# Altium schematic sheet STM32G431CBU6.SchDoc
size A3; SheetNumber: 2; SheetTotal: 6
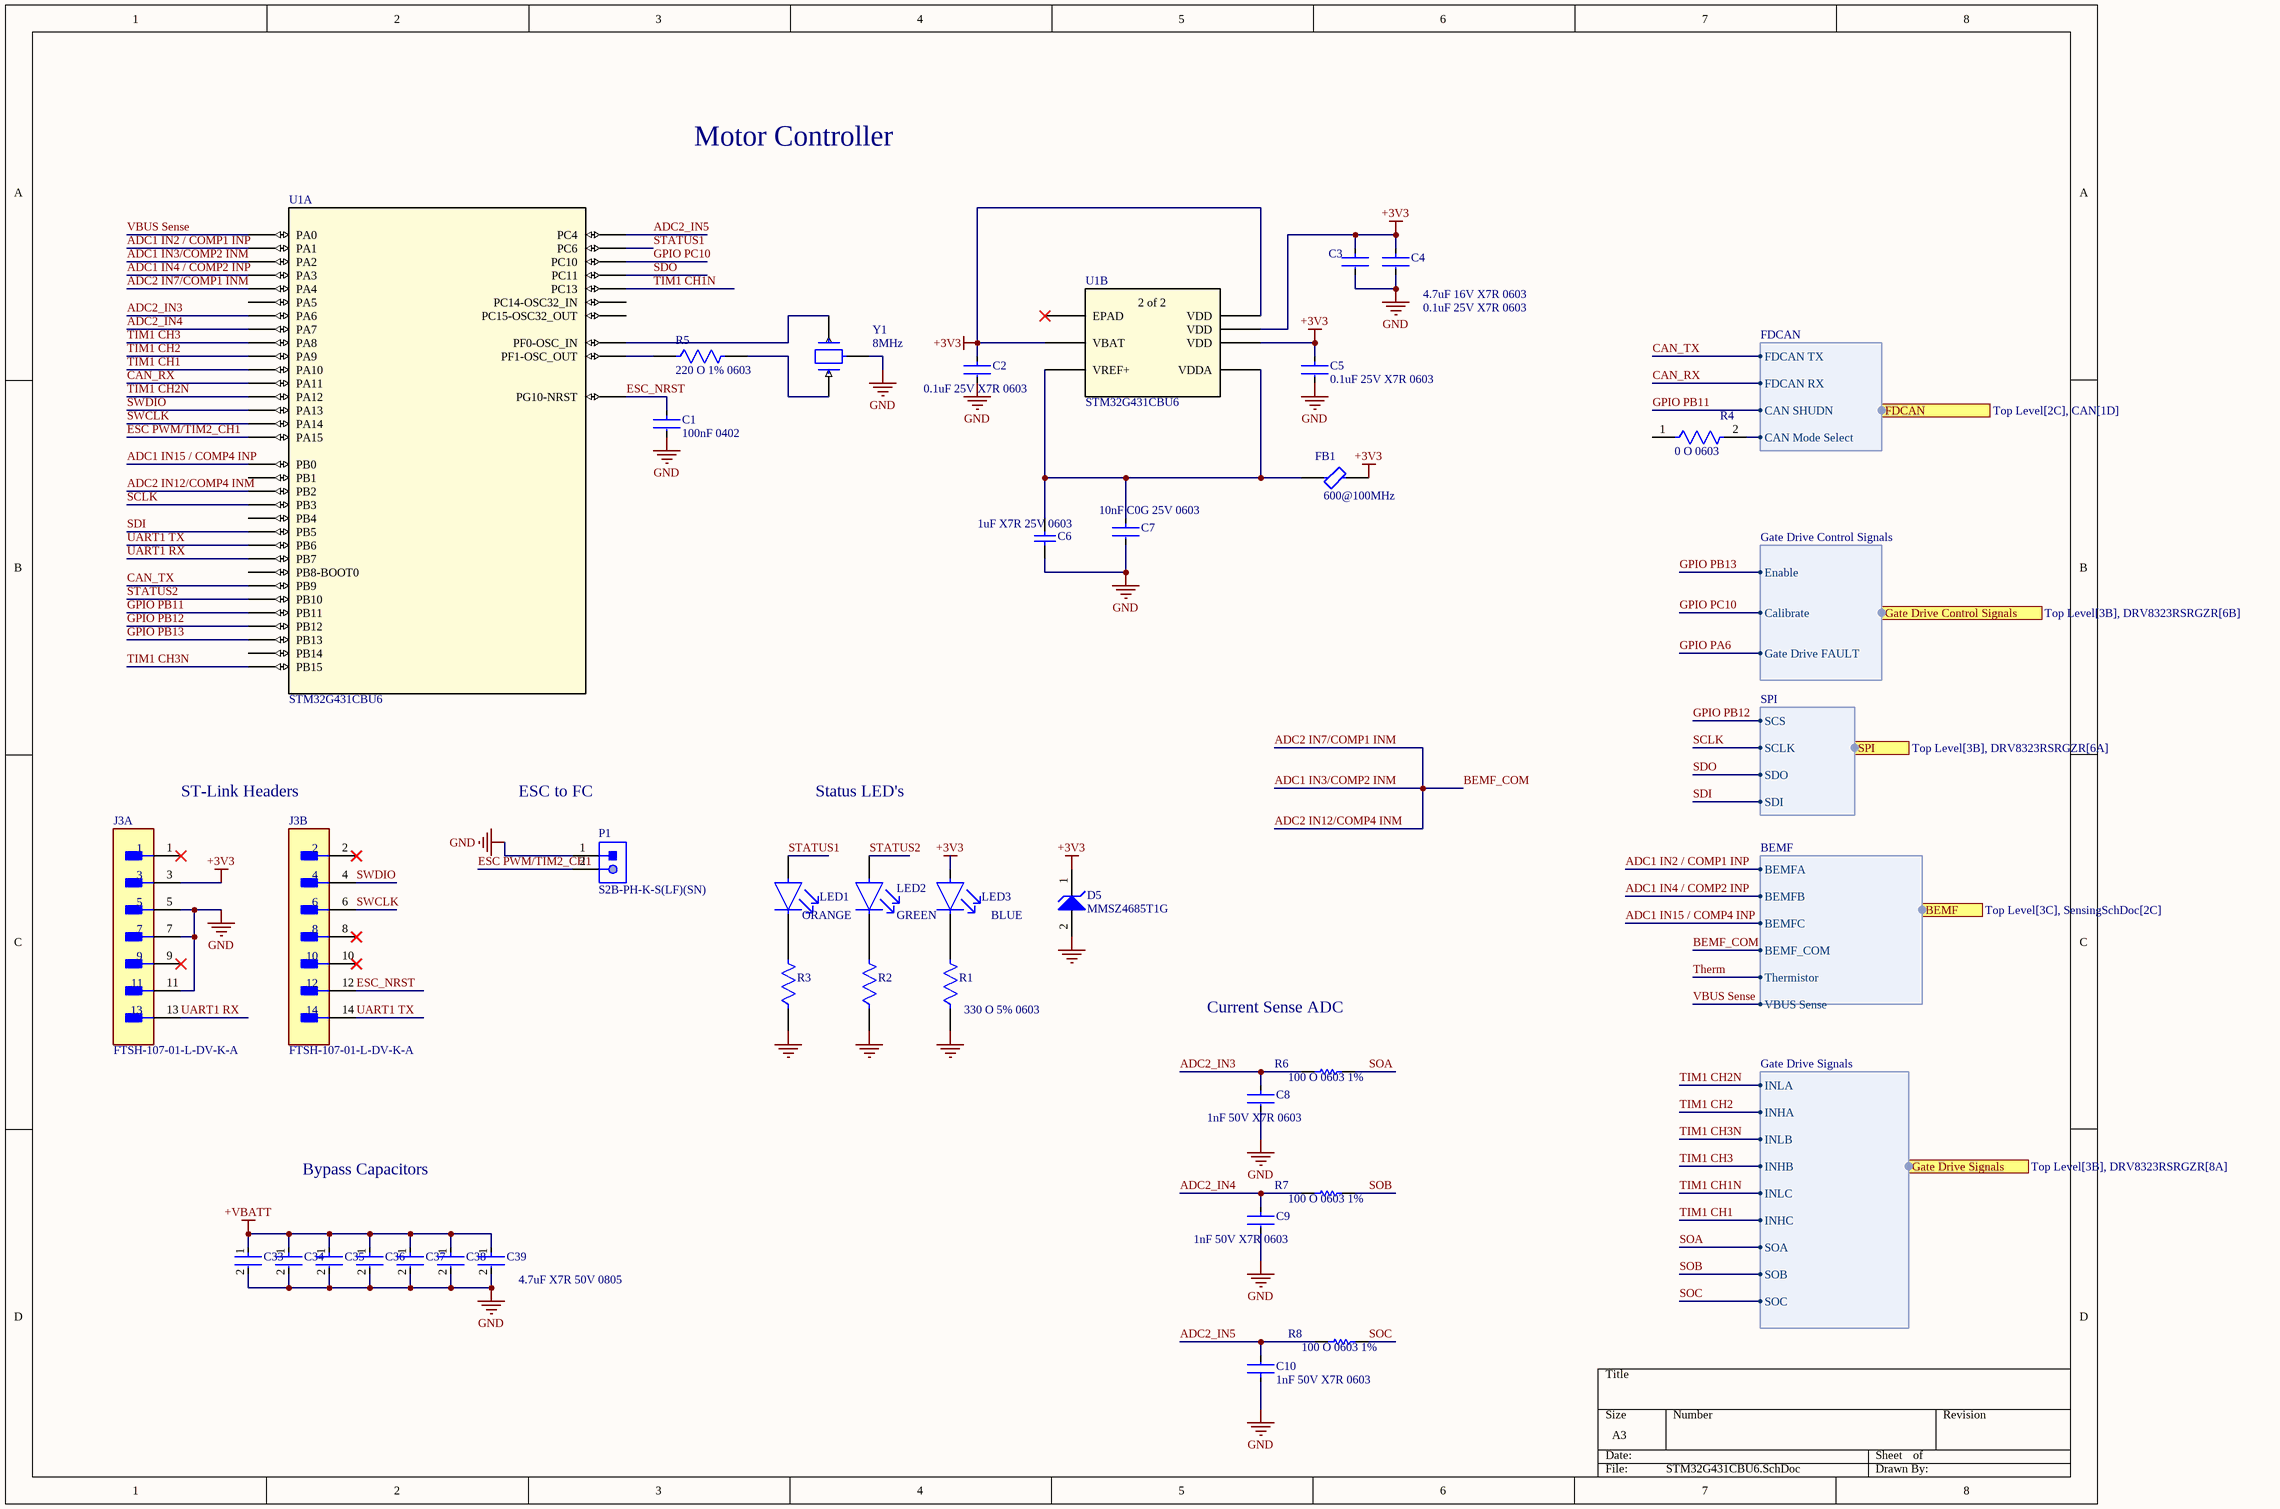
[diagram p0: STM32G431CBU6.SchDoc]

## Parts
C1  100nF 0402  [FP-GRM155-0_05-MFG]
C2  0.1uF 25V X7R 0603  [FP-C0603C-CF-MFG]
C3  4.7uF 16V X7R 0603  [FP-GRM188-0_2-IPC_A]
C4  0.1uF 25V X7R 0603  [FP-C0603C-CF-MFG]
C5  0.1uF 25V X7R 0603  [FP-C0603C-CF-MFG]
C6  1uF X7R 25V 0603  [CAPC1608X95X35NL15T15]
C7  10nF C0G 25V 0603  [FP-C0603C-CF-MFG]
C8  1nF 50V X7R 0603  [FP-C0603C-CF-MFG]
C9  1nF 50V X7R 0603  [FP-C0603C-CF-MFG]
C10  1nF 50V X7R 0603  [FP-C0603C-CF-MFG]
C33  4.7uF X7R 50V 0805  [FP-GRM21B-0_2-e0_2_0_7-IPC_C]  (value not drawn)
C34  4.7uF X7R 50V 0805  [FP-GRM21B-0_2-e0_2_0_7-IPC_C]  (value not drawn)
C35  4.7uF X7R 50V 0805  [FP-GRM21B-0_2-e0_2_0_7-IPC_C]  (value not drawn)
C36  4.7uF X7R 50V 0805  [FP-GRM21B-0_2-e0_2_0_7-IPC_C]  (value not drawn)
C37  4.7uF X7R 50V 0805  [FP-GRM21B-0_2-e0_2_0_7-IPC_C]  (value not drawn)
C38  4.7uF X7R 50V 0805  [FP-GRM21B-0_2-e0_2_0_7-IPC_C]  (value not drawn)
C39  4.7uF X7R 50V 0805  [FP-GRM21B-0_2-e0_2_0_7-IPC_C]
D5  MMSZ4685T1G  [ONSC-SOD-123-2-425-04_V]
FB1  600@100MHz  [FP-MPZ1608-0_8-MFG]
J3  FTSH-107-01-L-DV-K-A  [FP-FTSH-107-01-L-DV-K-A-MFG]  (parts A,B of 2)
LED1  ORANGE  [FP-6_541-5092_01-4-MFG]
LED2  GREEN  [FP-LTST-C193KGKT-5A-MFG]
LED3  BLUE  [FP-APT1608QBC-D-MFG]
P1  S2B-PH-K-S(LF)(SN)  [JST-S2B-PH-K-S_V]
R1  330 O 5% 0603  [FP-AC0603-IPC_C]
R2  AC0603JR-07330RL  [FP-AC0603-IPC_C]  (value not drawn)
R3  AC0603JR-07330RL  [FP-AC0603-IPC_C]  (value not drawn)
R4  0 O 0603  [FP-MCT0603-IPC_C]
R5  220 O 1% 0603  [FP-AC0603-IPC_A]
R6  100 O 0603 1%  [RESC1608X55X25ML10T15]
R7  100 O 0603 1%  [RESC1608X55X25ML10T15]
R8  100 O 0603 1%  [RESC1608X55X25ML10T15]
U1  STM32G431CBU6  [UFQFPN-48_7X7X0P55MM]  (parts A,B of 2)
Y1  8MHz  [FP-CSTNE8M00GH5C000R0-MFG]

## Ports
BEMF (harness BEMF, see Top Level[3C], SensingSchDoc[2C]), FDCAN (harness FDCAN, see Top Level[2C], CAN[1D]), Gate Drive Control Signals (harness Gate Drive Control Signals, see Top Level[3B], DRV8323RSRGZR[6B]), Gate Drive Signals (harness Gate Drive Signals, see Top Level[3B], DRV8323RSRGZR[8A]), SPI (harness SPI, see Top Level[3B], DRV8323RSRGZR[6A])

## Harnesses
SPI: SCLK, SDO, SDI, SCS
Gate Drive Signals: INLA, INHA, INLB, INHB, INLC, INHC, SOA, SOB, SOC
Gate Drive Control Signals: Enable, Calibrate, Gate Drive FAULT
BEMF: BEMFA, BEMFB, BEMFC, VBUS Sense, Thermistor, BEMF_COM
FDCAN: FDCAN TX, FDCAN RX, CAN SHUDN, CAN Mode Select

## Nets
+3V3: C2.1 C3.1 C4.1 C5.1 D5.1(K) FB1.2 J3.3 LED3.2(A) U1.1(VBAT) U1.23(VDD) U1.35(VDD) U1.48(VDD)
+VBATT: C33.1 C34.1 C35.1 C36.1 C37.1 C38.1 C39.1
GND: C1.2 C2.2 C3.2 C4.2 C5.2 C6.1 C7.2 C8.2 C9.2 C10.1 C33.2 C34.2 C35.2 C36.2 C37.2 C38.2 C39.2 D5.2(A) J3.5 J3.7 J3.11 P1.1 R1.1 R2.1 R3.1 Y1.2(GND)
ADC1 IN2 / COMP1 INP: U1.9(PA1) ; port BEMF.BEMFA
ADC1 IN3/COMP2 INM: U1.10(PA2) U1.12(PA4) U1.19(PB2) ; port BEMF.BEMF_COM  [also labelled ADC2 IN12/COMP4 INM, ADC2 IN7/COMP1 INM, BEMF_COM]
ADC1 IN4 / COMP2 INP: U1.11(PA3) ; port BEMF.BEMFB
ADC1 IN15 / COMP4 INP: U1.17(PB0) ; port BEMF.BEMFC
ADC2_IN3: C8.1 R6.1 U1.14(PA6)
ADC2_IN4: C9.1 R7.1 U1.15(PA7)
ADC2_IN5: C10.2 R8.1 U1.16(PC4)
CAN_RX: U1.33(PA11) ; port FDCAN.FDCAN RX
CAN_TX: U1.47(PB9) ; port FDCAN.FDCAN TX
ESC PWM/TIM2_CH1: P1.2 U1.38(PA15)
ESC_NRST: C1.1 J3.12 U1.7(PG10-NRST)
GPIO PA6: port Gate Drive Control Signals.Gate Drive FAULT
GPIO PB11: U1.24(PB11) ; port FDCAN.CAN SHUDN
GPIO PB12: U1.25(PB12) ; port SPI.SCS
GPIO PB13: U1.26(PB13) ; port Gate Drive Control Signals.Enable
GPIO PC10: U1.39(PC10) ; port Gate Drive Control Signals.Calibrate
SCLK: U1.41(PB3) ; port SPI.SCLK
SDI: U1.43(PB5) ; port SPI.SDI
SDO: U1.40(PC11) ; port SPI.SDO
SOA: R6.2 ; port Gate Drive Signals.SOA
SOB: R7.2 ; port Gate Drive Signals.SOB
SOC: R8.2 ; port Gate Drive Signals.SOC
STATUS1: LED1.2(A) U1.29(PC6)
STATUS2: LED2.2(A) U1.22(PB10)
SWCLK: J3.6 U1.37(PA14)
SWDIO: J3.4 U1.36(PA13)
Therm: port BEMF.Thermistor
TIM1 CH1: U1.32(PA10) ; port Gate Drive Signals.INHC
TIM1 CH1N: U1.2(PC13) ; port Gate Drive Signals.INLC
TIM1 CH2: U1.31(PA9) ; port Gate Drive Signals.INHA
TIM1 CH2N: U1.34(PA12) ; port Gate Drive Signals.INLA
TIM1 CH3: U1.30(PA8) ; port Gate Drive Signals.INHB
TIM1 CH3N: U1.28(PB15) ; port Gate Drive Signals.INLB
UART1 RX: J3.13 U1.45(PB7)
UART1 TX: J3.14 U1.44(PB6)
VBUS Sense: U1.8(PA0) ; port BEMF.VBUS Sense
NetC6_2: C6.2 C7.1 FB1.1 U1.20(VREF+) U1.21(VDDA)
NetLED1_1: LED1.1(C) R3.2
NetLED2_1: LED2.1(C) R2.2
NetLED3_1: LED3.1(C) R1.2
NetR4_2: R4.2 ; port FDCAN.CAN Mode Select
NetR5_1: R5.1 U1.6(PF1-OSC_OUT)
NetR5_2: R5.2 Y1.1(Input)
NetU1_5: U1.5(PF0-OSC_IN) Y1.3(Output)

Not connected (* = marked no-connect by the designer): J3 1* 2* 8* 9* 10*; R4 1; U1 3(PC14-OSC32_IN) 4(PC15-OSC32_OUT) 13(PA5) 18(PB1) 27(PB14) 42(PB4) 46(PB8-BOOT0) 49(EPAD)*

## Notes on the sheet
- Motor Controller
- ST-Link Headers
- ESC to FC
- Status LED's
- Current Sense ADC
- Bypass Capacitors
- (in symbol STM32G431CBU6, part B) 2 of 2

## Library data of the parts
C1 = CMP-06035-025734-1: Chip Multilayer Ceramic Capacitors for General Purpose, 0402, 0.10uF, X7R, 15%, 20%, 25V
C2 C4 C5 = CMP-2006-03731-2: CAP CER 0.1UF 25V X7R 0603; Manufacturer Part Number: C0603C104K3RACAUTO; Manufacturer: KEMET; Capacitance: 0.10 μF; Automotive Grade: Grade 1; Tolerance: 0.1; Material: Ceramic; Temperature Coefficient: 30ppm/°C; Value: 0.10 μF; Digikey Description: CAP CER 0.1UF 25V X7R 0603; RoHS: TRUE; ComponentLink2Description: Datasheet; Temperature Range High: +125°C; Temperature Characteristic: X7R; Automotive: Yes; Package: C0603C-CF; ComponentLink2URL: https://api.kemet.com/component-edge/download/datasheet/C0603C100J5GACAUTO.pdf; Lead Free: Yes; Device Class L2: Capacitors; Device Class L3: Ceramic Capacitors; Device Class L1: Passive Components; Octopart: https://octopart.com/c0603c104k3racauto-kemet-12595587; Height: 0.87mm; Mouser Description: Multilayer Ceramic Capacitors MLCC - SMD/SMT 0.1uF 25volts 10% X7R AUTO; Category: Cap; Voltage Rating: 25 V; Temperature Range Low: -55°C; Temperature: -55°C to +125°C
C3 = CMP-06035-045467-1: Chip Multilayer Ceramic Capacitors for General Purpose, 0603, 4.7uF, X7R, 15%, 10%, 16V
C6 = CMP-2006-02217-1: Part Number: C0603C105M3RACTU; Manufacturer: Kemet
C7 = CMP-03020-015349-1: C0603 10,000 pF C0G 30ppm/°C 5.00% 25 V; Manufacturer: KEMET; Manufacturer Part Number: C0603C103J3GACAUTO; Automotive Grade: Grade 1; Material: Ceramic; Tolerance: 0.05; Mouser Description: Cap Ceramic 0.01uF 25V C0G 5% Pad SMD 0603 125C Automotive T/R; Temperature Characteristic: C0G; Device Class L3: Ceramic Capacitors; Device Class L1: Passive Components; Capacitance: 10,000 pF; Temperature Range High: +125°C; Voltage Rating: 25 V; RoHS: TRUE; Temperature: -55°C to +125°C; Device Class L2: Capacitors; Temperature Range Low: -55°C; Package: C0603C-CF; Value: 10,000 pF; ComponentLink2Description: Datasheet; Height: 0.87mm; Octopart: https://octopart.com/c0603c103j3gacauto-kemet-75532652; Lead Free: Yes; Automotive: Yes; ComponentLink2URL: https://api.kemet.com/component-edge/download/datasheet/C0603C100J5GACAUTO.pdf; Category: Cap; Temperature Coefficient: 30ppm/°C
C8-C10 = CMP-2006-03716-2: CAP CER 1000PF 50V X7R 0603; Manufacturer Part Number: C0603C102K5RACAUTO; Manufacturer: KEMET; Material: Ceramic; Automotive Grade: Grade 1; Value: 1,000 pF; Tolerance: 0.1; Temperature Coefficient: 30ppm/°C; Category: Cap; Automotive: Yes; Temperature Range High: +125°C; Temperature Range Low: -55°C; Temperature Characteristic: X7R; Device Class L1: Passive Components; Height: 0.87mm; Lead Free: Yes; Capacitance: 1,000 pF; Package: C0603C-CF; Digikey Description: CAP CER 1000PF 50V X7R 0603; Voltage Rating: 50 V; ComponentLink2URL: https://api.kemet.com/component-edge/download/datasheet/C0603C100J5GACAUTO.pdf; Mouser Description: Multilayer Ceramic Capacitors MLCC - SMD/SMT 1000pF 50volts 10% X7R AUTO; RoHS: TRUE; Octopart: https://octopart.com/c0603c102k5racauto-kemet-18822673; Device Class L3: Ceramic Capacitors; ComponentLink2Description: Datasheet; Device Class L2: Capacitors; Temperature: -55°C to +125°C
C33-C39 = CMP-06035-056600-1: Chip Multilayer Ceramic Capacitors for General Purpose, 0805, 4.7uF, X7R, 15%, 10%, 50V
D5 = CMP-1060-00574-1: Zener Voltage Regulator, 500 mW, 2-Pin SOD-123, Pb-Free, Tape and Reel; Manufacturer: On Semiconductor; VZ Typ (V): 3.6; P Max (W): 0.5; DatasheetVersion: Rev. 9; ComponentLink2Description: Datasheet; Mounting Technology: Surface Mount; ComponentLink3URL: http://www.onsemi.com/pub_link/Collateral/425-04.PDF; ComponentLink3Description: Package Specification; RoHS: Pb-Free; PartNumber: MMSZ4685T1G; ComponentLink1URL: http://www.onsemi.com/; PackageDescription: 2-Pin SOD, Body 1.6 x 2.69 mm; ComponentLink2URL: http://www.onsemi.com/pub_link/Collateral/MMSZ4678T1-D.PDF; ComponentLink1Description: Manufacturer URL; Packing: Tape and Reel; PackageVersion: Rev. G, 10/2009; PackageReference: SOD-123-2-425-04
FB1 = CMP-08257-000179-1: Power line Ferrite Bead 600Ω @ 100MHz 1A DCR 0.15Ω SMD 0603; Impedance: 600R; DC Resistance (DCR): 150mR; Tolerance: 25%; Depth: 0.8mm; Packaging: Tape and Reel; Package Quantity: 4000; Height: 0.8mm; Length: 0.063inch; Series: MPZ; Weight: 7.1E-05oz; Width: 0.8mm; Mount: Surface Mount; Case Code (Imperial): 0603; Case/Package: 0603; Max Operating Temperature: 125°C; Max DC Current: 1A; Test Frequency: 100MHz; Min Operating Temperature: -55°C; Current Rating: 1A; Core Material: Ferrite; RoHS Compliant: Yes; REACH SVHC: No SVHC; Case Code (Metric): 1608; Termination: SMD/SMT; Lead Free: Lead Free
J3 = CMP-02766-001414-1: CONN HEADER SMD 14POS 1.27MM; Number of Contacts: 14; Gender: Male; Contact Plating: Gold; Termination: Solder; Lead Free: Lead Free; Contact Material: Bronze; Pitch: 1.27mm; Number of Rows: 2; RoHS Compliant: Yes
LED1 = CMP-00030-21709200-1: VLMO1300-GS08 LED Uni-Color Soft Orange 611nm 2-Pin Chip 0603(1608Metric) T/R; Test Current: 20mA; Dominant Wavelength: 605nm; Lens Style: Clear, Rectangular; Reverse Voltage: 5V; Power Dissipation: 75mW; Luminous Intensity: 90mcd; Viewing Angle: 130°; Number of LEDs: 1; Forward Voltage: 2V; Illumination Color: Orange; Ambient Temperature Range High: 85°C; Radiation Hardening: No; Case Code (Metric): 1608; Case Code (Imperial): 0603; Forward Current: 20mA; Number of Pins: 2; Packaging: Cut Tape; Case/Package: 0603; Depth: 800µm; RoHS: Compliant; Schedule B: 8541402000, 8541402000; Length: 1.6mm; Power Rating: 75mW; Mount: Surface Mount; NexarPartId: 21709200; Min Operating Temperature: -35°C; Width: 800µm; REACH SVHC: Unknown; Lead Free: Lead Free; Color: Orange; Wavelength: 605nm; Max Operating Temperature: 85°C; Height: 800µm; Number of Elements: 1
LED2 = CMP-2000-06622-2: LED GREEN CLEAR CHIP SMD; Forward Current: 30mA; Power Dissipation: 75mW; Luminous Intensity: 28mcd; Lens Style: Diffused; Lens Color: Colorless; Forward Voltage: 2.3V; Test Current: 5mA; Viewing Angle: 130°; Reverse Voltage: 5V; Dominant Wavelength: 576.5nm; Number of Elements: 1; Number of Pins: 2; Case/Package: 0603; Width: 0.8mm; Radiation Hardening: No; Lead Free: Lead Free; Lens Transparency: Clear; Max Operating Temperature: 85°C; Illumination Color: Green; Color: Green; Packaging: Tape and Reel; Depth: 0.8mm; Length: 1.6mm; Mount: Surface Mount; Case Code (Imperial): 0603; Height: 0.35mm; Min Operating Temperature: -55°C; Package Quantity: 3000; Case Code (Metric): 1608; Power Rating: 75mW; Number of LEDs: 1
LED3 = CMP-2000-05788-2: LED BLUE CLEAR CHIP SMD; Lens Style: Flat; Forward Current: 20mA; Luminous Intensity: 100mcd; Number of LEDs: 1; Dominant Wavelength: 465nm; Lens Color: Colorless; Forward Voltage: 3.3V; Viewing Angle: 120°; Case Code (Imperial): 0603; Number of Pins: 2; Length: 1.6mm; Mount: Surface Mount; Color: Blue; Width: 0.8mm; Height: 0.75mm; Case/Package: 0603; Lead Free: Lead Free; Case Code (Metric): 1608; Lens Transparency: Clear; Min Operating Temperature: -40°C; Packaging: Tape and Reel; Max Operating Temperature: 85°C; Package Quantity: 2000; Test Current: 20mA; Illumination Color: Blue
P1 = CMP-1755-00004-1: Male Header, Pitch 2 mm, 1 x 2 Position, Height 4.8 mm, Tail Length 3.4 mm, -25 to 85 degC, RoHS, Bulk; Case\Package: Radial; Tolerance: 20%; Capacitance: 10 uF; Voltage Rating (DC): 50 V; Packaging: Bulk; ComponentLink1URL: http://www.jst-mfg.com/product/pdf/eng/ePH.pdf; Radiation Hardening: No; Height: 11 mm; Package Quantity: 200; PackageDescription: Male Header, Pitch 2 mm, 1 x 2 Position, Height 4.8 mm, Tail Length 3.4 mm; PackageReference: S2B-PH-K-S; Diameter: 5 mm; Pins: 2; Mount: Through Hole; Max Operating Temperature: 85 degC; Min Operating Temperature: -40 degC; ComponentLink1Description: Datasheet; DatasheetVersion: Dec-12; Length: 11 mm; Lead Pitch: 2 mm; REACH SVHC: No SVHC; Voltage Rating: 50 V; RoHSCompliant: true
R1 = CMP-03412-039929-1: RES 330Ω 5.00% 0.1W 0603; Voltage Rating: 50V; Power Rating: 100mW; Temperature Coefficient: 100ppm/°C; Resistance: 330R; Series: AC; Case/Package: 0603; Weight: 7.1E-05oz; Min Operating Temperature: -55°C; Ratings: AEC-Q200; Width: 0.8mm; Resistor Type: Thick Film; Termination: SMD/SMT; Tolerance: 5%; Number of Terminations: 2; Max Power Dissipation: 100mW; Case Code (Imperial): 0603; Case Code (Metric): 1608; Height: 0.45mm; Max Operating Temperature: 155°C; Length: 1.6mm; RoHS Compliant: Yes; Features: Moisture Resistant; Packaging: Tape and Reel
R2 R3 = CMP-03412-039929-1: RES 330Ω 5.00% 0.1W 0603; Voltage Rating: 50V; Power Rating: 100mW; Tolerance: 5%; Temperature Coefficient: 100ppm/°C; Resistance: 330R; Series: AC; Case/Package: 0603; Weight: 7.1E-05oz; Min Operating Temperature: -55°C; Ratings: AEC-Q200; Width: 0.8mm; Resistor Type: Thick Film; Termination: SMD/SMT; Number of Terminations: 2; Max Power Dissipation: 100mW; Case Code (Imperial): 0603; Case Code (Metric): 1608; Height: 0.45mm; Max Operating Temperature: 155°C; Length: 1.6mm; RoHS Compliant: Yes; Features: Moisture Resistant; Packaging: Tape and Reel
R4 = CMP-02407-001385-1: RES SMD 100 OHM 1% 1/8W 0603; Voltage Rating (DC): 75V; Resistance: 0mR; Max Power Dissipation: 125mW; Power Rating: 100mW; Case Code (Imperial): 0603; Packaging: Tape and Reel; Length: 1.55mm; Case Code (Metric): 1608; Military Standard: Not; Lead Free: Lead Free; Width: 0.033inch; Voltage Rating: 75V; Case/Package: 0603; Composition: Thin Film; Radiation Hardening: No; Depth: 0.85mm; Max Operating Temperature: 125°C; Number of Terminations: 2; Height: 0.022inch; REACH SVHC: No SVHC; Mount: Surface Mount; Package Quantity: 1; Contact Plating: Tin; Min Operating Temperature: -55°C
R5 = CMP-03412-024663-2: RES 220Ω 1.00% 0.1W 0603; Max Power Dissipation: 100mW; Voltage Rating: 50V; Temperature Coefficient: 100ppm/°C; Resistance: 220R; Max Operating Temperature: 155°C; Case/Package: 0603; Case Code (Imperial): 0603; RoHS Compliant: Yes; Height: 0.45mm; Case Code (Metric): 1608; Resistor Type: Thick Film; Width: 0.8mm; Series: AC; Number of Terminations: 2; Features: Moisture Resistant; Tolerance: 1%; Ratings: AEC-Q200; Min Operating Temperature: -55°C; Power Rating: 100mW; Packaging: Tape and Reel; Termination: SMD/SMT; Length: 1.6mm
R6-R8 = CMP-2000-04173-1: Part Number: RC0603FR-10100RL; Manufacturer: Yageo
U1 = STM32G431CBU6: Mainstream Arm Cortex-M4 MCU 170 MHz with 128 Kbytes of Flash memory, Math Accelerator, Medium Analog level integration; Manufacturer_Name: STMicroelectronics; Copyright: Copyright (C) 2025 Ultra Librarian. All rights reserved.; Manufacturer_Part_Number: STM32G431CBU6; Datasheet: https://www.st.com/resource/en/datasheet/stm32g431c6.pdf; RefDes: RefDes; Type: Type
Y1 = CMP-06057-000001-1: CERAMIC RES 8.0000MHZ 33PF SMD; Frequency Stability: 0.13%; Frequency Tolerance: 0.07%; Impedance: 40R; Mount: Surface Mount; Min Operating Temperature: -40°C; Max Operating Temperature: 125°C; Resistor Type: Ceramic; Capacitance: 33pF; Packaging: Tape and Reel; Frequency: 8MHz; Case/Package: SMD/SMT